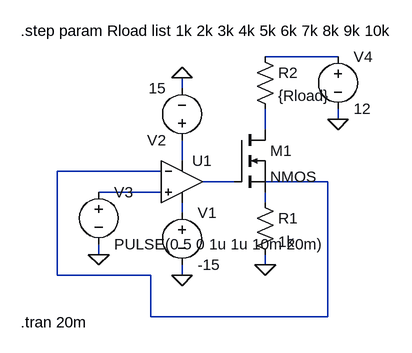
[diagram p0: schematic VCCS_sim.asc]
VCCS_sim.asc, the LTspice schematic file:
Version 4.1
SHEET 1 880 680
WIRE 464 -32 352 -32
WIRE 224 16 224 0
WIRE 464 64 464 48
WIRE 352 80 352 48
WIRE 224 128 224 96
WIRE 192 144 32 144
WIRE 304 160 256 160
WIRE 448 160 352 160
WIRE 192 176 96 176
WIRE 352 192 352 176
WIRE 224 208 224 192
WIRE 96 272 96 256
WIRE 352 288 352 272
WIRE 32 304 32 144
WIRE 176 304 32 304
WIRE 224 304 224 288
WIRE 176 368 176 304
WIRE 448 368 448 160
WIRE 448 368 176 368
FLAG 224 0 0
FLAG 464 64 0
FLAG 352 288 0
FLAG 224 304 0
FLAG 96 272 0
SYMBOL OpAmps\\UniversalOpAmp 224 160 R0
SYMATTR InstName U1
SYMBOL voltage 224 192 R0
WINDOW 123 0 0 Left 0
WINDOW 39 0 0 Left 0
SYMATTR InstName V1
SYMATTR Value -15
SYMBOL voltage 224 112 R180
WINDOW 123 0 0 Left 0
WINDOW 39 0 0 Left 0
SYMATTR InstName V2
SYMATTR Value 15
SYMBOL voltage 96 160 R0
WINDOW 123 0 0 Left 0
WINDOW 39 0 0 Left 0
SYMATTR InstName V3
SYMATTR Value PULSE(0 5 0 1u 1u 10m 20m)
SYMBOL voltage 464 -48 R0
WINDOW 123 0 0 Left 0
WINDOW 39 0 0 Left 0
SYMATTR InstName V4
SYMATTR Value 12
SYMBOL nmos 304 80 R0
SYMATTR InstName M1
SYMBOL res 336 176 R0
SYMATTR InstName R1
SYMATTR Value 1k
SYMBOL res 336 -48 R0
SYMATTR InstName R2
SYMATTR Value {Rload}
TEXT -24 -72 Left 2 !.step param Rload list 1k 2k 3k 4k 5k 6k 7k 8k 9k 10k
TEXT -24 376 Left 2 !.tran 20m

The netlist it stands for:
* VCCS_sim.asc
X§U1 N006 N004 N003 N008 N005 level1 Avol=1Meg GBW=10Meg Vos=0 En=0 Enk=0 In=0 Ink=0 Rin=500Meg  ; pins In+ In- V+ V- OUT
V1 N008 0 -15
V2 N003 0 15
V3 N006 0 PULSE(0 5 0 1u 1u 10m 20m)
V4 N001 0 12
M1 N002 N005 N007 N007 NMOS
R1 N007 0 1k
R2 N001 N002 {Rload}
.model NMOS NMOS
.model PMOS PMOS
.lib standard.mos
.step param Rload list 1k 2k 3k 4k 5k 6k 7k 8k 9k 10k
.tran 20m
.lib UniversalOpAmp1.lib
.backanno
.end